# Altium schematic sheet USB.SchDoc
size A3; PageSetup: Record=PageOptions|CenterHorizontal=True|CenterVertical=True|PrintScale=0.73|XCorrection=1.00|YCorrection=1.00|PrintKind=0|BorderSize=5000000|LeftOffset=0|BottomOffset=0|Orientation=2|PaperLength=1000|PaperWidth=1000|Scale=100|PaperSource=7|PrintQuality=-4|MediaType=1|DitherType=10|PaperKind=A4|PrintScaleMode=1; Date: 27.05.2014; DrawnBy: luths8; Organization: BFH; Address1: Bern University of Applied Sciences; Address2: Engineering and Information Technology; Address3: Jlcoweg 1; Address4: CH-3400 Burgdorf; DocumentNumber: 5; Revision: 1.1; SheetNumber: 5; SheetTotal: 16; CurrentDate: 27.05.2014
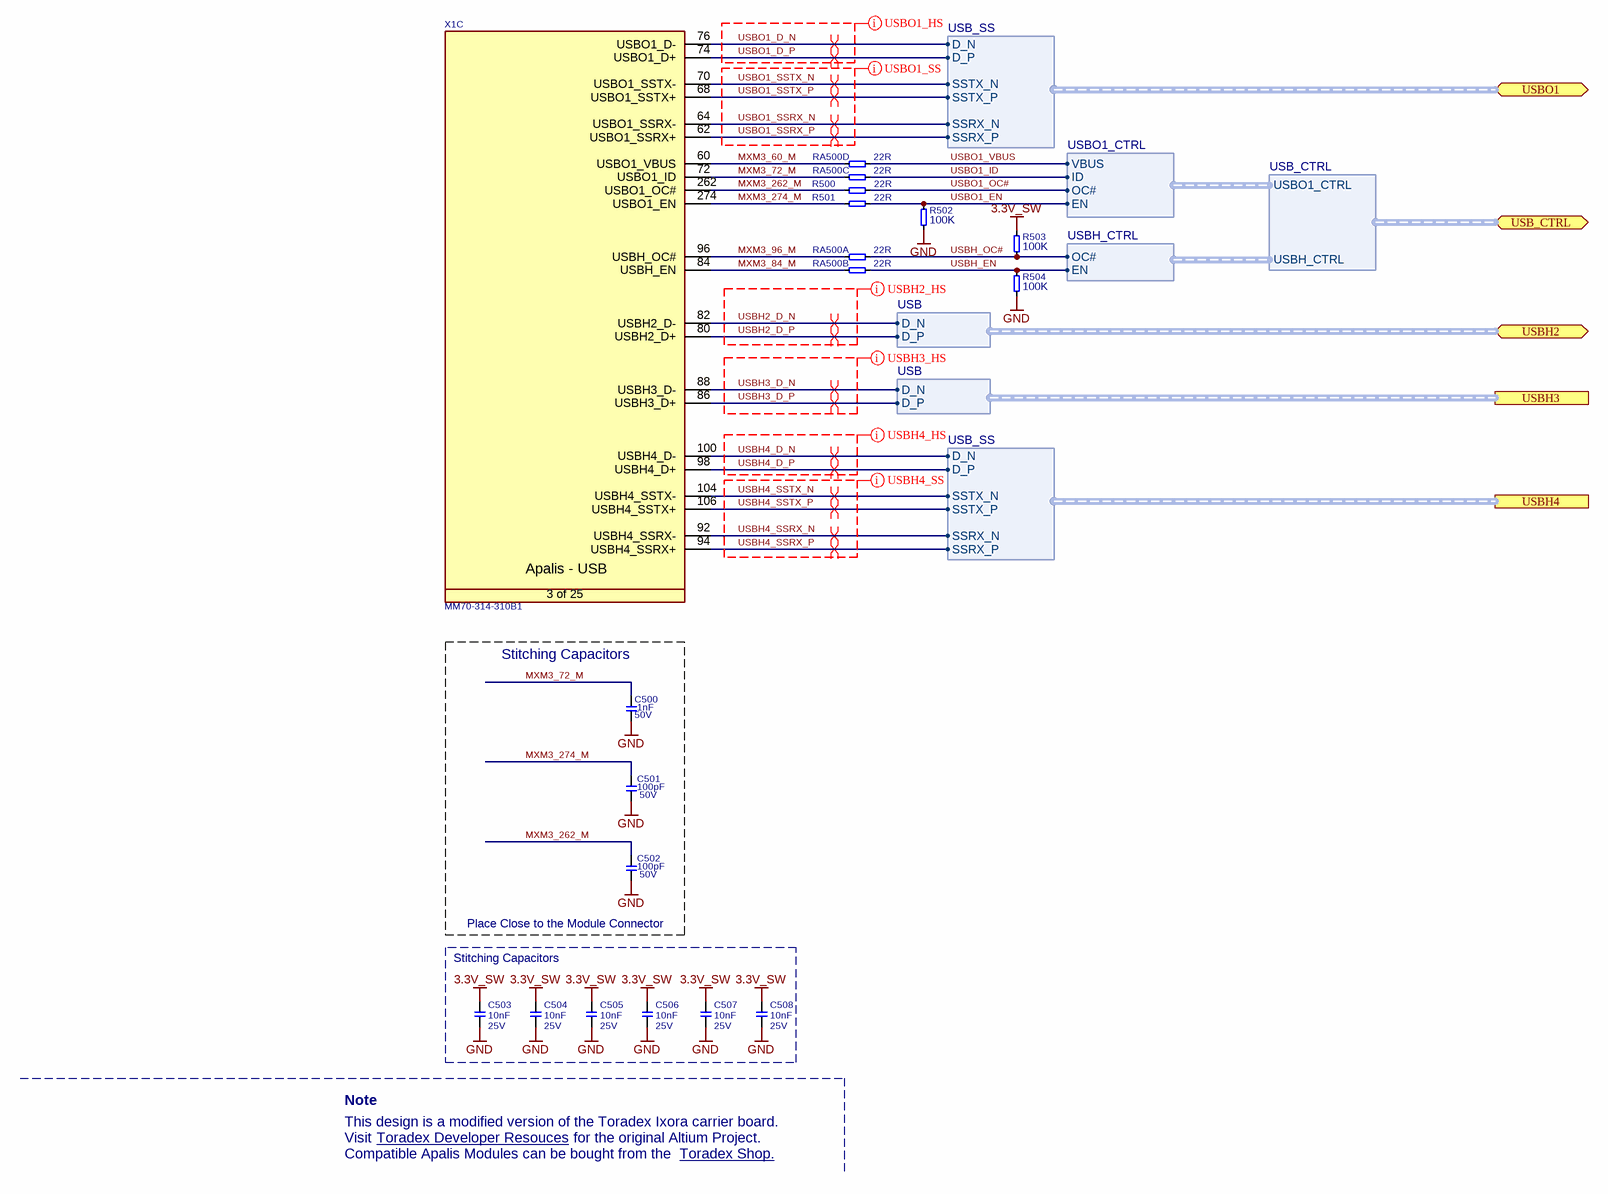
[diagram p0: USB.SchDoc]

## Parts
C500  Rating: 50V  [SMD0603CAP]  (hidden comment: 1nF)
C501  Rating: 50V  [SMD0603CAP]  (hidden comment: 100pF)
C502  Rating: 50V  [SMD0603CAP]  (hidden comment: 100pF)
C503  10nF  Rating: 25V  [SMD0603CAP]
C504  10nF  Rating: 25V  [SMD0603CAP]
C505  10nF  Rating: 25V  [SMD0603CAP]
C506  10nF  Rating: 25V  [SMD0603CAP]
C507  10nF  Rating: 25V  [SMD0603CAP]
C508  10nF  Rating: 25V  [SMD0603CAP]
R500  22R  [SMD0603RES]
R501  22R  [SMD0603RES]
R502  100K  [SMD0603RES]
R503  100K  [SMD0603RES]
R504  100K  [SMD0603RES]
RA500  22R  [T_Resistor_Array_X4]  (parts A,B,C,D of 4)
X1  Manufacturer Part No.: MM70-314-310B1  [T_JAE_MM70-314-310B1]  (hidden comment: CON-JAE-MM70-314-310B1-314-0.5mm)  (part C of 25)

## Blocks framed on the sheet
Stitching Capacitors: C500-C502

## Ports
USB_CTRL (bidir, harness USB_CTRL), USBH2 (bidir, harness USB), USBH3 (harness USB), USBH4 (harness USB_SS), USBO1 (bidir, harness USB_SS)

## Harnesses
USB_SS: D_N, D_P, SSTX_N, SSTX_P, SSRX_N, SSRX_P
USB: D_N, D_P
USBO1_CTRL: VBUS, ID, OC#, EN
USBH_CTRL: OC#, EN
USB_CTRL: USBO1_CTRL, USBH_CTRL

## Nets
3.3V_SW: C503.2 C504.2 C505.2 C506.2 C507.2 C508.2 R503.1
GND: C500.1 C501.1 C502.1 C503.1 C504.1 C505.1 C506.1 C507.1 C508.1 R502.1 R504.1
MXM3_60_M: RA500.1 X1.60(USBO1_VBUS)
MXM3_72_M: C500.2 RA500.2 X1.72(USBO1_ID)
MXM3_84_M: RA500.3 X1.84(USBH_EN)
MXM3_96_M: RA500.4 X1.96(USBH_OC#)
MXM3_262_M: C502.2 R500.1 X1.262(USBO1_OC#)
MXM3_274_M: C501.2 R501.1 X1.274(USBO1_EN)
USBH2_D_N: X1.82(USBH2_D-) ; port USBH2.D_N
USBH2_D_P: X1.80(USBH2_D+) ; port USBH2.D_P
USBH3_D_N: X1.88(USBH3_D-) ; port USBH3.D_N
USBH3_D_P: X1.86(USBH3_D+) ; port USBH3.D_P
USBH4_D_N: X1.100(USBH4_D-) ; port USBH4.D_N
USBH4_D_P: X1.98(USBH4_D+) ; port USBH4.D_P
USBH4_SSRX_N: X1.92(USBH4_SSRX-) ; port USBH4.SSRX_N
USBH4_SSRX_P: X1.94(USBH4_SSRX+) ; port USBH4.SSRX_P
USBH4_SSTX_N: X1.104(USBH4_SSTX-) ; port USBH4.SSTX_N
USBH4_SSTX_P: X1.106(USBH4_SSTX+) ; port USBH4.SSTX_P
USBH_EN: R504.2 RA500.7 ; harness USBH_CTRL.EN
USBH_OC#: R503.2 RA500.8 ; harness USBH_CTRL.OC#
USBO1_D_N: X1.76(USBO1_D-) ; port USBO1.D_N
USBO1_D_P: X1.74(USBO1_D+) ; port USBO1.D_P
USBO1_EN: R501.2 R502.2 ; harness USBO1_CTRL.EN
USBO1_ID: RA500.6 ; harness USBO1_CTRL.ID
USBO1_OC#: R500.2 ; harness USBO1_CTRL.OC#
USBO1_SSRX_N: X1.64(USBO1_SSRX-) ; port USBO1.SSRX_N
USBO1_SSRX_P: X1.62(USBO1_SSRX+) ; port USBO1.SSRX_P
USBO1_SSTX_N: X1.70(USBO1_SSTX-) ; port USBO1.SSTX_N
USBO1_SSTX_P: X1.68(USBO1_SSTX+) ; port USBO1.SSTX_P
USBO1_VBUS: RA500.5 ; harness USBO1_CTRL.VBUS

## Layout directives
differential pair: USBH2_D_N, USBH2_D_P, USBH3_D_N, USBH3_D_P, USBH4_D_N, USBH4_D_P, USBH4_SSRX_N, USBH4_SSRX_P, USBH4_SSTX_N, USBH4_SSTX_P, USBO1_D_N, USBO1_D_P, USBO1_SSRX_N, USBO1_SSRX_P, USBO1_SSTX_N, USBO1_SSTX_P
net class USBO1_SS: USBO1_SSRX_N, USBO1_SSRX_P, USBO1_SSTX_N, USBO1_SSTX_P
net class USBO1_HS: USBO1_D_N, USBO1_D_P
net class USBH2_HS: USBH2_D_N, USBH2_D_P
net class USBH3_HS: USBH3_D_N, USBH3_D_P
net class USBH4_SS: USBH4_SSRX_N, USBH4_SSRX_P, USBH4_SSTX_N, USBH4_SSTX_P
net class USBH4_HS: USBH4_D_N, USBH4_D_P

## Notes on the sheet
- (near C502) Place Close to the Module Connector
- Stitching Capacitors
- Note
- This design is a modified version of the Toradex Ixora carrier board.
- Visit
- Compatible Apalis Modules can be bought from the
- Toradex Developer Resouces <https://developer.toradex.com/products/ixora-carrier-board>
- for the original Altium Project.
- Toradex Shop. <https://www.toradex.com/order-now/apalis-arm-family>
- Project:
- Size:
- Sheet:
- Title:
- A3
- of
- Drawn by:
- Revision:
- Date:
- Variant:
- b
- File:
- (in symbol CON-JAE-MM70-314-310B1-314-0.5mm, part C) Apalis - USB; 3 of 25

## Library data of the parts
C500 = C-X7R-1nF-50V-10%-0402: Capacitor Ceramic X7R 1nF 50V 10% 0603; Tolerance: 10%; Type: X7R; Value: 1nF
C501 C502 = C-X7R-100pF-50V-10%-0402: Capacitor Ceramic X7R 100pF 50V 10% 0603; Tolerance: 10%; Type: X7R; Value: 100pF
C503-C508 = C-X7R-10nF-25V-10%-0603: Capacitor Ceramic X7R 10nF 25V 10% 0603; Tolerance: 10%; Type: X7R; Value: 10nF
R500 R501 = R-22R-63mW-5%-0402: Resistor 22 ohm 63mW 5% 0603; Rating: 63mW; Tolerance: 5%; Value: 22R
R502-R504 = R-100KR-63mW-5%-0402: Resistor 100 Kohm 63mW 5% 0603; Value: 100KR; Rating: 63mW; Tolerance: 5%
RA500 = RA-22R-63mW-5%-1206-div: Resistor Array 22 R 63mW 5% 1206; Tolerance: 5%; Power Dissipation: 63mW; Value: 22R
X1 = CON-JAE-MM70-314-310B1-314-0.5mm: MXM3 Connector; Manufacturer Name: JAE; No. of ways: 314